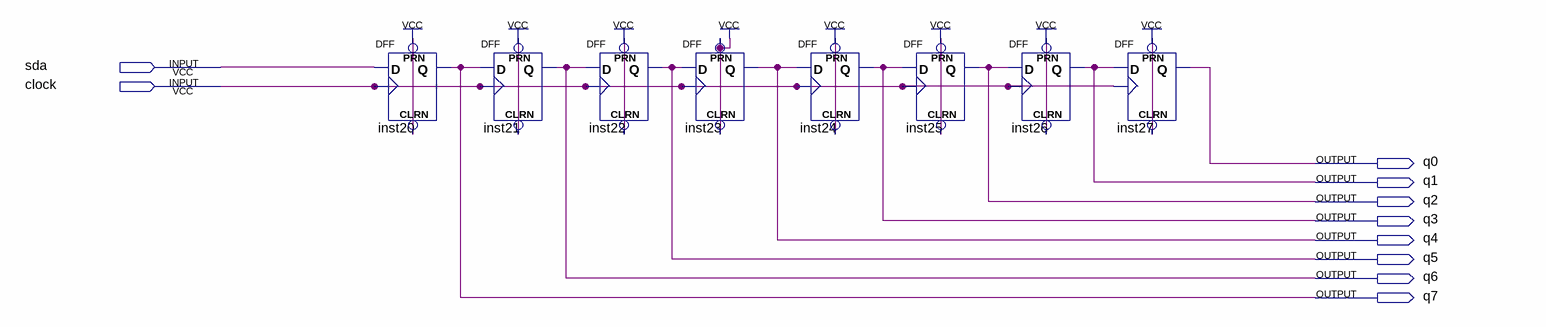
[diagram p0: schematic sheet]
// Quartus schematic regsp8b.bdf as structural Verilog: 8 symbols, 10 pins
module regsp8b (
  input  sda,
  input  clock,
  output q0,
  output q1,
  output q2,
  output q3,
  output q4,
  output q5,
  output q6,
  output q7
);

  DFF inst20 (.CLRN(1'b1), .CLK(clock), .D(sda), .PRN(1'b1), .Q(q7));
  DFF inst21 (.CLRN(1'b1), .CLK(clock), .D(q7), .PRN(1'b1), .Q(q6));
  DFF inst22 (.CLRN(1'b1), .CLK(clock), .D(q6), .PRN(1'b1), .Q(q5));
  DFF inst23 (.CLRN(1'b1), .CLK(clock), .D(q5), .PRN(1'b1), .Q(q4));
  DFF inst24 (.CLRN(1'b1), .CLK(clock), .D(q4), .PRN(1'b1), .Q(q3));
  DFF inst25 (.CLRN(1'b1), .CLK(clock), .D(q3), .PRN(1'b1), .Q(q2));
  DFF inst26 (.CLRN(1'b1), .CLK(clock), .D(q2), .PRN(1'b1), .Q(q1));
  DFF inst27 (.CLRN(1'b1), .CLK(clock), .D(q1), .PRN(1'b1), .Q(q0));
endmodule
